# Altium schematic sheet 磁感采集.SchDoc
size A4
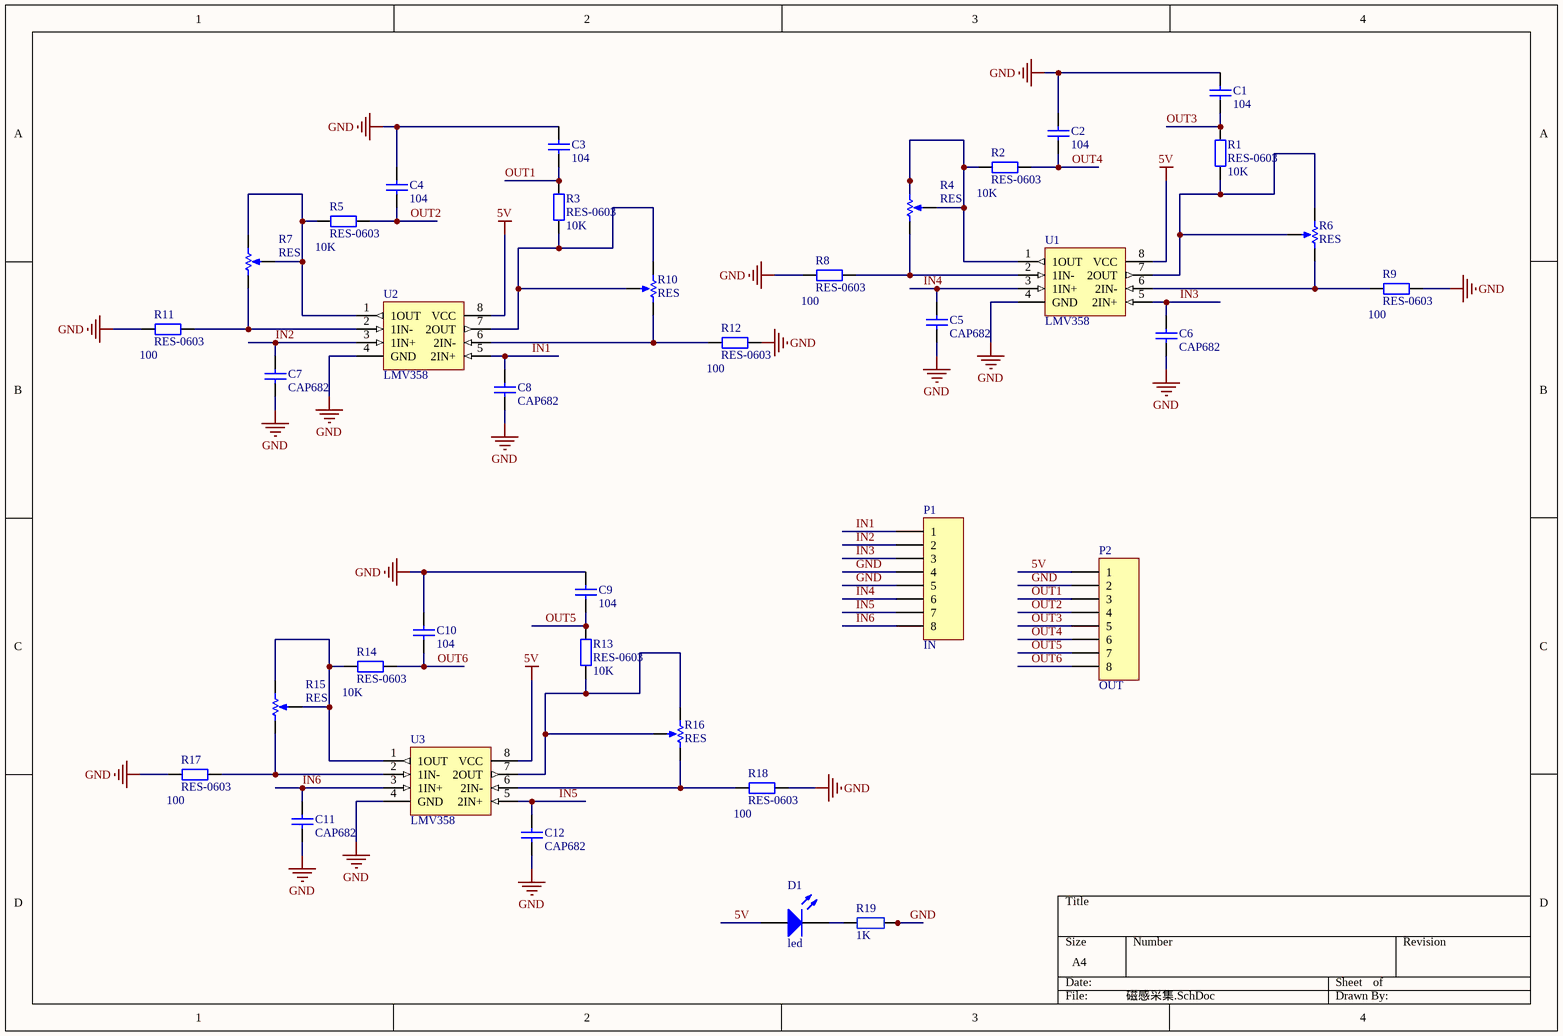
[diagram p0: 磁感采集.SchDoc]

## Parts
C1  104  [CAP-0603]
C2  104  [CAP-0603]
C3  104  [CAP-0603]
C4  104  [CAP-0603]
C5  CAP682  [CAP682]
C6  CAP682  [CAP682]
C7  CAP682  [CAP682]
C8  CAP682  [CAP682]
C9  104  [CAP-0603]
C10  104  [CAP-0603]
C11  CAP682  [CAP682]
C12  CAP682  [CAP682]
D1  led  [led0805]
P1  IN  [HDR1X8]
P2  OUT  [HDR1X8]
R1  RES-0603  [RES-0603]
R2  RES-0603  [RES-0603]
R3  RES-0603  [RES-0603]
R4  RES  [RES-change-3362P]
R5  RES-0603  [RES-0603]
R6  RES  [RES-change-3362P]
R7  RES  [RES-change-3362P]
R8  RES-0603  [RES-0603]
R9  RES-0603  [RES-0603]
R10  RES  [RES-change-3362P]
R11  RES-0603  [RES-0603]
R12  RES-0603  [RES-0603]
R13  RES-0603  [RES-0603]
R14  RES-0603  [RES-0603]
R15  RES  [RES-change-3362P]
R16  RES  [RES-change-3362P]
R17  RES-0603  [RES-0603]
R18  RES-0603  [RES-0603]
R19  RES-0805  [RES-0805]  (value not drawn)
U1  LMV358  [SOP-8]
U2  LMV358  [SOP-8]
U3  LMV358  [SOP-8]

## Nets
5V: D1.1(A) P2.1 U1.8(VCC) U2.8(VCC) U3.8(VCC)
GND: C1.2 C2.2 C3.2 C4.2 C5.1 C6.2 C7.1 C8.2 C9.2 C10.2 C11.1 C12.2 P1.4 P1.5 P2.2 R8.1 R9.2 R11.1 R12.2 R17.1 R18.2 R19.2 U1.4(GND) U2.4(GND) U3.4(GND)
IN1: C8.1 P1.1 U2.5(2IN+)
IN2: C7.2 P1.2 U2.3(1IN+)
IN3: C6.1 P1.3 U1.5(2IN+)
IN4: C5.2 P1.6 U1.3(1IN+)
IN5: C12.1 P1.7 U3.5(2IN+)
IN6: C11.2 P1.8 U3.3(1IN+)
OUT1: C3.1 P2.3 R3.2
OUT2: C4.1 P2.4 R5.2
OUT3: C1.1 P2.5 R1.2
OUT4: C2.1 P2.6 R2.2
OUT5: C9.1 P2.7 R13.2
OUT6: C10.1 P2.8 R14.2
NetD1_2: D1.2(K) R19.1
NetR1_1: R1.1 R6.1(TOP) R6.3(TAP) U1.7(2OUT)
NetR2_1: R2.1 R4.2(BOT) R4.3(TAP) U1.1(1OUT)
NetR3_1: R3.1 R10.1(TOP) R10.3(TAP) U2.7(2OUT)
NetR4_1: R4.1(TOP) R8.2 U1.2(1IN-)
NetR5_1: R5.1 R7.2(BOT) R7.3(TAP) U2.1(1OUT)
NetR6_2: R6.2(BOT) R9.1 U1.6(2IN-)
NetR7_1: R7.1(TOP) R11.2 U2.2(1IN-)
NetR10_2: R10.2(BOT) R12.1 U2.6(2IN-)
NetR13_1: R13.1 R16.1(TOP) R16.3(TAP) U3.7(2OUT)
NetR14_1: R14.1 R15.2(BOT) R15.3(TAP) U3.1(1OUT)
NetR15_1: R15.1(TOP) R17.2 U3.2(1IN-)
NetR16_2: R16.2(BOT) R18.1 U3.6(2IN-)

## Notes on the sheet
- (in symbol RES-0603) 10K; 100
- (in symbol RES-0805) 1K

## Library data of the parts
C1-C4 C9 C10 = CAP-0603
C5-C8 C11 C12 = CAP 682
D1 = led0805
P1 P2 = Header 8: Header, 8-Pin; LatestRevisionDate: 17-Jul-2002; LatestRevisionNote: Re-released for DXP Platform.; Publisher: Altium Limited
R4 R6 R7 R10 R15 R16 = RES-change-3362P